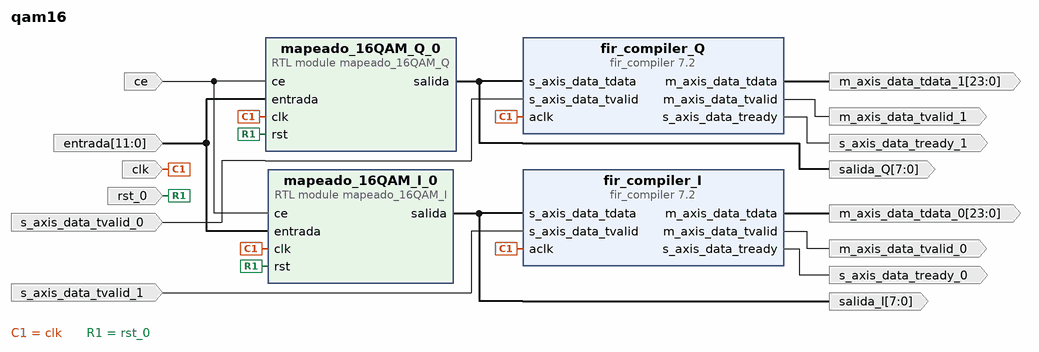
[diagram p0: block diagram of the top level]
# Vivado block design qam16, xc7k70tfbg484-2L, Vivado 2017.4
create_bd_design qam16

create_bd_port -dir I -type clk clk
set_property -dict {CONFIG.FREQ_HZ 192000000} [get_bd_ports clk]
create_bd_port -dir I ce
create_bd_port -dir I -from 11 -to 0 entrada
create_bd_port -dir I -type rst rst_0
create_bd_port -dir O -from 23 -to 0 m_axis_data_tdata_0
create_bd_port -dir O -from 23 -to 0 m_axis_data_tdata_1
create_bd_port -dir O m_axis_data_tvalid_0
create_bd_port -dir O m_axis_data_tvalid_1
create_bd_port -dir O s_axis_data_tready_1
create_bd_port -dir I s_axis_data_tvalid_0
create_bd_port -dir I s_axis_data_tvalid_1
create_bd_port -dir O s_axis_data_tready_0
create_bd_port -dir O -from 7 -to 0 salida_I
create_bd_port -dir O -from 7 -to 0 salida_Q

create_bd_cell -type ip -vlnv xilinx.com:ip:fir_compiler:7.2 fir_compiler_I
set_property -dict [list \
  CONFIG.CoefficientSource Vector \
  CONFIG.CoefficientVector -0.00663867853767272,-0.00602169653714084,-0.00529347118529176,-0.00445824548864446,-0.0035218321918853,-0.00249160301669963,-0.00137645802195132,-0.000186774814536972,0.00106566242199441,0.00236775386984364,0.00370519453152383,0.00506260348947667,0.00642367101778738,0.00777132235261769,0.0090878966959861,0.0103553398069446,0.0115554083279177,0.012669883804758,0.0136807941895475,0.0145706404677674,0.0153226259283814,0.0159208854985838,0.0163507124961381,0.0165987801127473,0.0166533549328094,0.0165044998139274,0.0161442635090165,0.0155668544947696,0.014768796587225,0.013749064071461,0.0125091942479061,0.011053375500908,0.00938850922421195,0.00752424419069521,0.00547298222760699,0.00324985435090727,0.0008726668200585,-0.00163818310544666,-0.00425982159788389,-0.00696704243769444,-0.00973248015553795,-0.0125268110281898,-0.0153189804897603,-0.0180764552029428,-0.0207654977318963,-0.0233514614725648,-0.0257991032311911,-0.0280729106007981,-0.0301374410715249,-0.0319576696267094,-0.0334993414249872,-0.0347293260515622,-0.0356159697409923,-0.0361294419306986,-0.0362420724999499,-0.0359286760838307,-0.0351668599258157,-0.0339373118457097,-0.0322240650511184,-0.0300147367090889,-0.0273007374184814,-0.0240774489809469,-0.0203443681566915,-0.0161052144076532,-0.0113679999722271,-0.00614506097870744,-0.000453048685568026,0.00568711966851974,0.0122503505174283,0.0192075038255421,0.0265255624422642,0.0341678398365667,0.0420942246950265,0.0502614604788459,0.0586234576638146,0.0671316360361168,0.0757352940902648,0.0843820022769118,0.093018016581241,0.101588708680126,0.110039008730984,0.118313856689522,0.126358657939291,0.134119738944527,0.141544798610179,0.148583351049813,0.155187155523179,0.161310629410294,0.166911240236868,0.171949872955418,0.17639116891563,0.180203833224029,0.18336090749422,0.185840005321611,0.18762350817729,0.188698719800761,0.189057977576521,0.188698719800761,0.18762350817729,0.185840005321611,0.18336090749422,0.180203833224029,0.17639116891563,0.171949872955418,0.166911240236868,0.161310629410294,0.155187155523179,0.148583351049813,0.141544798610179,0.134119738944527,0.126358657939291,0.118313856689522,0.110039008730984,0.101588708680126,0.093018016581241,0.0843820022769118,0.0757352940902648,0.0671316360361168,0.0586234576638146,0.0502614604788459,0.0420942246950265,0.0341678398365667,0.0265255624422642,0.0192075038255421,0.0122503505174283,0.00568711966851974,-0.000453048685568026,-0.00614506097870744,-0.0113679999722271,-0.0161052144076532,-0.0203443681566915,-0.0240774489809469,-0.0273007374184814,-0.0300147367090889,-0.0322240650511184,-0.0339373118457097,-0.0351668599258157,-0.0359286760838307,-0.0362420724999499,-0.0361294419306986,-0.0356159697409923,-0.0347293260515622,-0.0334993414249872,-0.0319576696267094,-0.0301374410715249,-0.0280729106007981,-0.0257991032311911,-0.0233514614725648,-0.0207654977318963,-0.0180764552029428,-0.0153189804897603,-0.0125268110281898,-0.00973248015553795,-0.00696704243769444,-0.00425982159788389,-0.00163818310544666,0.0008726668200585,0.00324985435090727,0.00547298222760699,0.00752424419069521,0.00938850922421195,0.011053375500908,0.0125091942479061,0.013749064071461,0.014768796587225,0.0155668544947696,0.0161442635090165,0.0165044998139274,0.0166533549328094,0.0165987801127473,0.0163507124961381,0.0159208854985838,0.0153226259283814,0.0145706404677674,0.0136807941895475,0.012669883804758,0.0115554083279177,0.0103553398069446,0.0090878966959861,0.00777132235261769,0.00642367101778738,0.00506260348947667,0.00370519453152383,0.00236775386984364,0.00106566242199441,-0.000186774814536972,-0.00137645802195132,-0.00249160301669963,-0.0035218321918853,-0.00445824548864446,-0.00529347118529176,-0.00602169653714084,-0.00663867853767272 \
  CONFIG.Coefficient_Sets 1 \
  CONFIG.Clock_Frequency 192 \
  CONFIG.Coefficient_Sign Signed \
  CONFIG.Quantization Quantize_Only \
  CONFIG.Coefficient_Width 16 \
  CONFIG.BestPrecision true \
  CONFIG.Coefficient_Fractional_Bits 17 \
  CONFIG.Coefficient_Structure Symmetric \
  CONFIG.Data_Width 8 \
  CONFIG.Data_Fractional_Bits 0 \
  CONFIG.Output_Rounding_Mode Truncate_LSBs \
  CONFIG.Output_Width 24 \
  CONFIG.Filter_Architecture Systolic_Multiply_Accumulate \
] [get_bd_cells fir_compiler_I]
create_bd_cell -type ip -vlnv xilinx.com:ip:fir_compiler:7.2 fir_compiler_Q
set_property -dict [list \
  CONFIG.CoefficientVector -0.00663867853767272,-0.00602169653714084,-0.00529347118529176,-0.00445824548864446,-0.0035218321918853,-0.00249160301669963,-0.00137645802195132,-0.000186774814536972,0.00106566242199441,0.00236775386984364,0.00370519453152383,0.00506260348947667,0.00642367101778738,0.00777132235261769,0.0090878966959861,0.0103553398069446,0.0115554083279177,0.012669883804758,0.0136807941895475,0.0145706404677674,0.0153226259283814,0.0159208854985838,0.0163507124961381,0.0165987801127473,0.0166533549328094,0.0165044998139274,0.0161442635090165,0.0155668544947696,0.014768796587225,0.013749064071461,0.0125091942479061,0.011053375500908,0.00938850922421195,0.00752424419069521,0.00547298222760699,0.00324985435090727,0.0008726668200585,-0.00163818310544666,-0.00425982159788389,-0.00696704243769444,-0.00973248015553795,-0.0125268110281898,-0.0153189804897603,-0.0180764552029428,-0.0207654977318963,-0.0233514614725648,-0.0257991032311911,-0.0280729106007981,-0.0301374410715249,-0.0319576696267094,-0.0334993414249872,-0.0347293260515622,-0.0356159697409923,-0.0361294419306986,-0.0362420724999499,-0.0359286760838307,-0.0351668599258157,-0.0339373118457097,-0.0322240650511184,-0.0300147367090889,-0.0273007374184814,-0.0240774489809469,-0.0203443681566915,-0.0161052144076532,-0.0113679999722271,-0.00614506097870744,-0.000453048685568026,0.00568711966851974,0.0122503505174283,0.0192075038255421,0.0265255624422642,0.0341678398365667,0.0420942246950265,0.0502614604788459,0.0586234576638146,0.0671316360361168,0.0757352940902648,0.0843820022769118,0.093018016581241,0.101588708680126,0.110039008730984,0.118313856689522,0.126358657939291,0.134119738944527,0.141544798610179,0.148583351049813,0.155187155523179,0.161310629410294,0.166911240236868,0.171949872955418,0.17639116891563,0.180203833224029,0.18336090749422,0.185840005321611,0.18762350817729,0.188698719800761,0.189057977576521,0.188698719800761,0.18762350817729,0.185840005321611,0.18336090749422,0.180203833224029,0.17639116891563,0.171949872955418,0.166911240236868,0.161310629410294,0.155187155523179,0.148583351049813,0.141544798610179,0.134119738944527,0.126358657939291,0.118313856689522,0.110039008730984,0.101588708680126,0.093018016581241,0.0843820022769118,0.0757352940902648,0.0671316360361168,0.0586234576638146,0.0502614604788459,0.0420942246950265,0.0341678398365667,0.0265255624422642,0.0192075038255421,0.0122503505174283,0.00568711966851974,-0.000453048685568026,-0.00614506097870744,-0.0113679999722271,-0.0161052144076532,-0.0203443681566915,-0.0240774489809469,-0.0273007374184814,-0.0300147367090889,-0.0322240650511184,-0.0339373118457097,-0.0351668599258157,-0.0359286760838307,-0.0362420724999499,-0.0361294419306986,-0.0356159697409923,-0.0347293260515622,-0.0334993414249872,-0.0319576696267094,-0.0301374410715249,-0.0280729106007981,-0.0257991032311911,-0.0233514614725648,-0.0207654977318963,-0.0180764552029428,-0.0153189804897603,-0.0125268110281898,-0.00973248015553795,-0.00696704243769444,-0.00425982159788389,-0.00163818310544666,0.0008726668200585,0.00324985435090727,0.00547298222760699,0.00752424419069521,0.00938850922421195,0.011053375500908,0.0125091942479061,0.013749064071461,0.014768796587225,0.0155668544947696,0.0161442635090165,0.0165044998139274,0.0166533549328094,0.0165987801127473,0.0163507124961381,0.0159208854985838,0.0153226259283814,0.0145706404677674,0.0136807941895475,0.012669883804758,0.0115554083279177,0.0103553398069446,0.0090878966959861,0.00777132235261769,0.00642367101778738,0.00506260348947667,0.00370519453152383,0.00236775386984364,0.00106566242199441,-0.000186774814536972,-0.00137645802195132,-0.00249160301669963,-0.0035218321918853,-0.00445824548864446,-0.00529347118529176,-0.00602169653714084,-0.00663867853767272 \
  CONFIG.Coefficient_Sets 1 \
  CONFIG.Clock_Frequency 192 \
  CONFIG.Coefficient_Sign Signed \
  CONFIG.Quantization Quantize_Only \
  CONFIG.Coefficient_Width 16 \
  CONFIG.Coefficient_Fractional_Bits 17 \
  CONFIG.Coefficient_Structure Symmetric \
  CONFIG.Data_Width 8 \
  CONFIG.Data_Fractional_Bits 0 \
  CONFIG.Output_Rounding_Mode Truncate_LSBs \
  CONFIG.Output_Width 23 \
  CONFIG.Filter_Architecture Systolic_Multiply_Accumulate \
] [get_bd_cells fir_compiler_Q]
create_bd_cell -type module -reference mapeado_16QAM_I mapeado_16QAM_I_0
create_bd_cell -type module -reference mapeado_16QAM_Q mapeado_16QAM_Q_0

# ---- connections ----

connect_bd_net [get_bd_ports clk] \
  [get_bd_pins fir_compiler_Q/aclk] [get_bd_pins fir_compiler_I/aclk] [get_bd_pins mapeado_16QAM_I_0/clk] \
  [get_bd_pins mapeado_16QAM_Q_0/clk]
connect_bd_net [get_bd_ports ce] [get_bd_pins mapeado_16QAM_I_0/ce] [get_bd_pins mapeado_16QAM_Q_0/ce]
connect_bd_net -net entrada_1_1 [get_bd_ports entrada] [get_bd_pins mapeado_16QAM_I_0/entrada] [get_bd_pins mapeado_16QAM_Q_0/entrada]
connect_bd_net -net rst_0_1 [get_bd_ports rst_0] [get_bd_pins mapeado_16QAM_I_0/rst] [get_bd_pins mapeado_16QAM_Q_0/rst]
connect_bd_net [get_bd_pins fir_compiler_I/m_axis_data_tdata] [get_bd_ports m_axis_data_tdata_0]
connect_bd_net [get_bd_pins fir_compiler_Q/m_axis_data_tdata] [get_bd_ports m_axis_data_tdata_1]
connect_bd_net [get_bd_pins fir_compiler_I/m_axis_data_tvalid] [get_bd_ports m_axis_data_tvalid_0]
connect_bd_net [get_bd_pins fir_compiler_Q/m_axis_data_tvalid] [get_bd_ports m_axis_data_tvalid_1]
connect_bd_net [get_bd_pins fir_compiler_Q/s_axis_data_tready] [get_bd_ports s_axis_data_tready_1]
connect_bd_net -net s_axis_data_tvalid_0_1 [get_bd_ports s_axis_data_tvalid_0] [get_bd_pins fir_compiler_Q/s_axis_data_tvalid]
connect_bd_net -net s_axis_data_tvalid_1_1 [get_bd_ports s_axis_data_tvalid_1] [get_bd_pins fir_compiler_I/s_axis_data_tvalid]
connect_bd_net [get_bd_pins fir_compiler_I/s_axis_data_tready] [get_bd_ports s_axis_data_tready_0]
connect_bd_net [get_bd_pins mapeado_16QAM_I_0/salida] [get_bd_ports salida_I] [get_bd_pins fir_compiler_I/s_axis_data_tdata]
connect_bd_net [get_bd_pins mapeado_16QAM_Q_0/salida] [get_bd_ports salida_Q] [get_bd_pins fir_compiler_Q/s_axis_data_tdata]

validate_bd_design
save_bd_design
